# EAGLE design remote emergency switch (EAGLE 9.6.2)
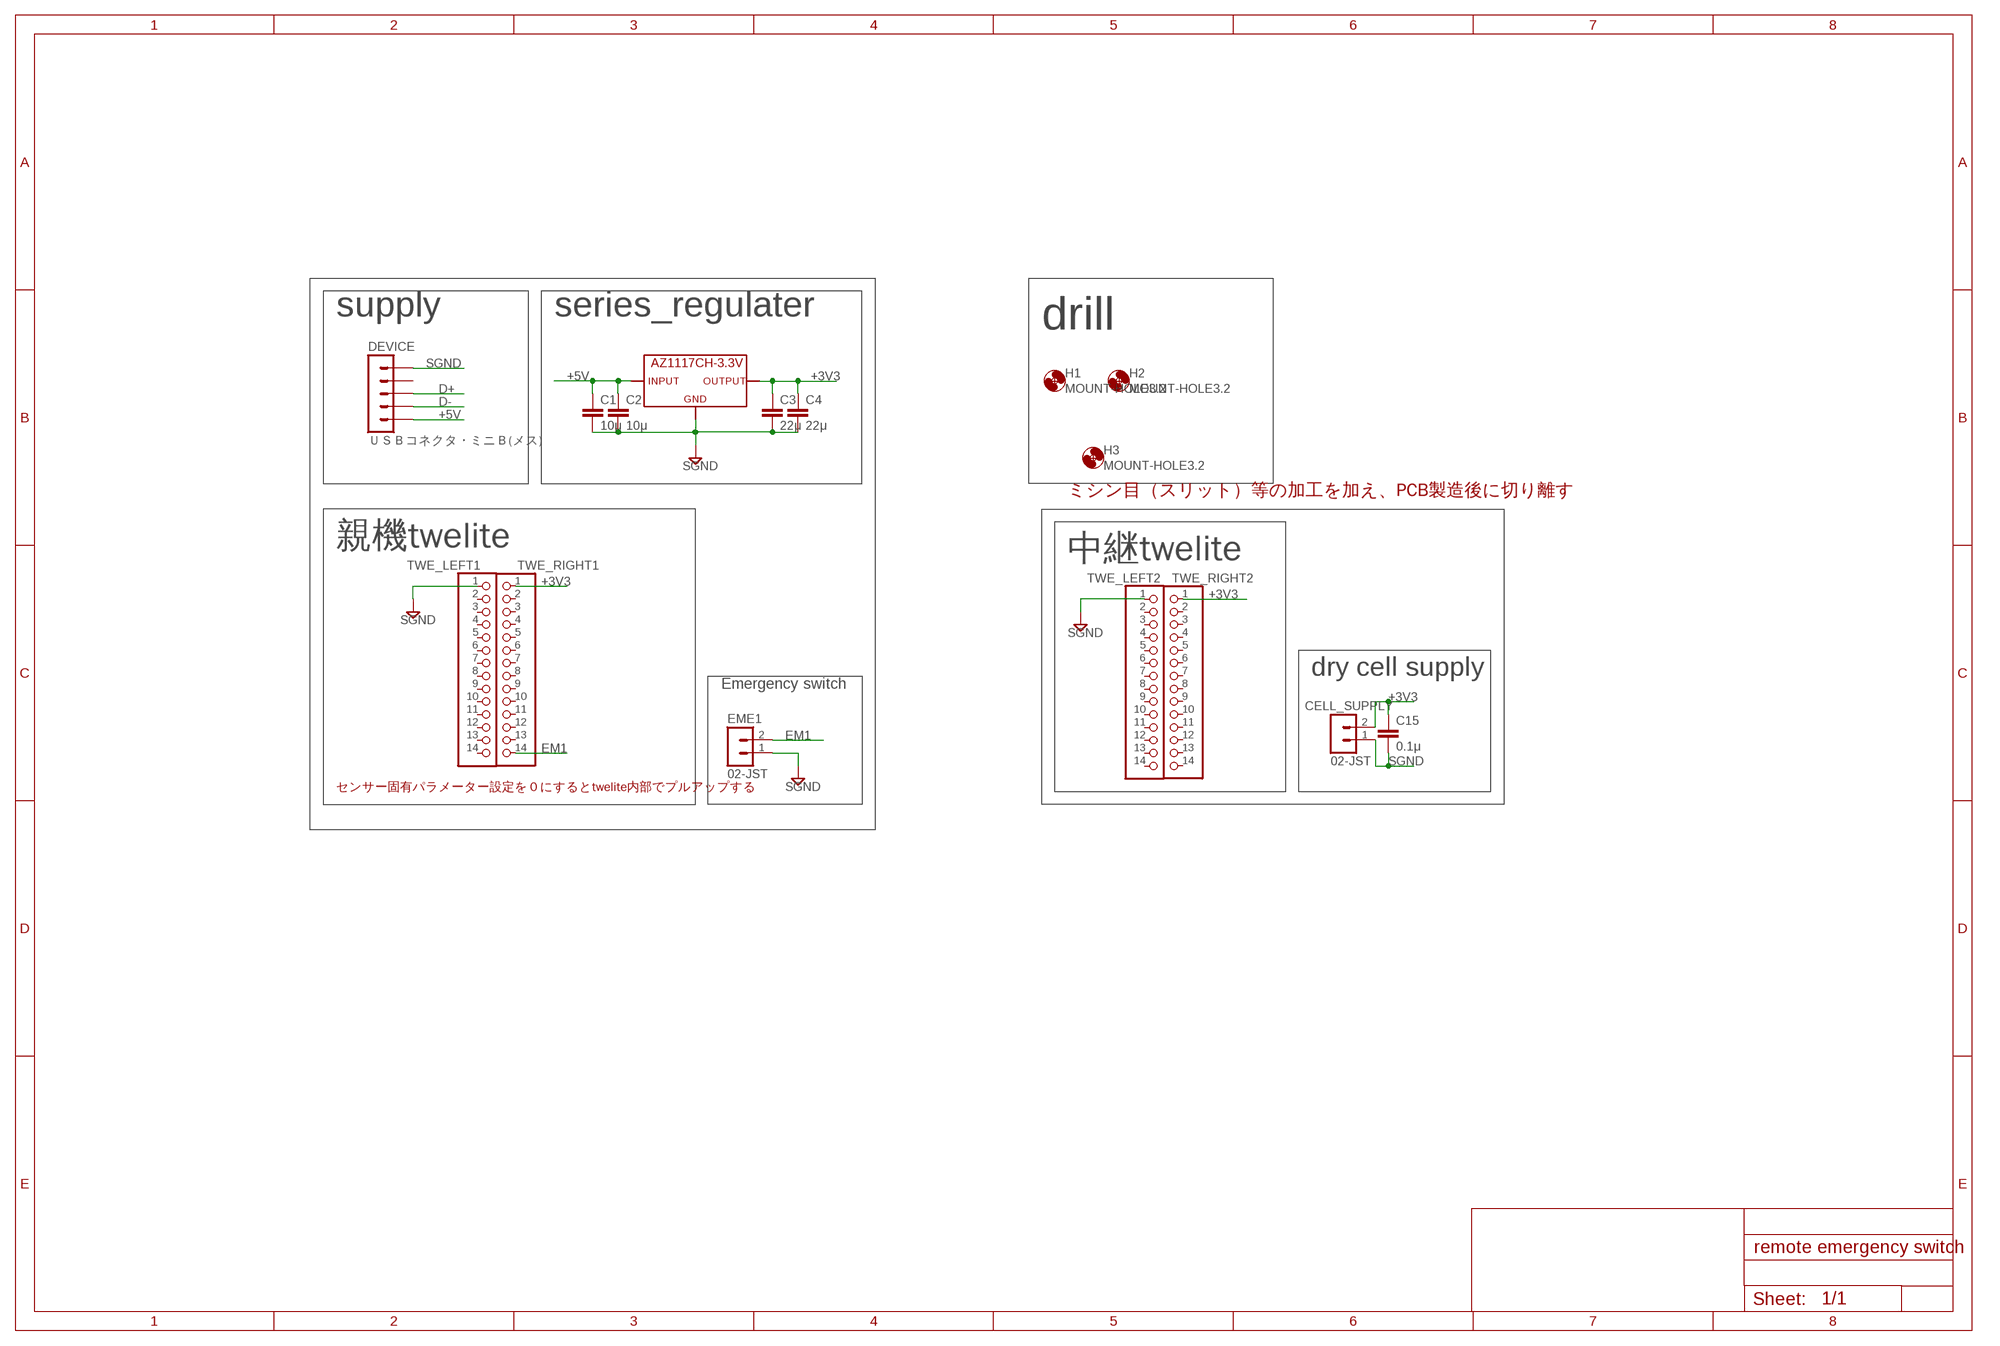
[diagram p0: schematic, sheet 1]

## Parts
C1  10μ  GRM0335C1E240GA01D  [GRM0335C1E240GA01D]
C2  10μ  GRM0335C1E240GA01D  [GRM0335C1E240GA01D]
C3  22μ  GRM0335C1E240GA01D  [GRM0335C1E240GA01D]
C4  22μ  GRM0335C1E240GA01D  [GRM0335C1E240GA01D]
C15  0.1μ  C-EU025-024X044  [C025-024X044]
CELL_SUPPLY  02-JST  [B2B-XH]
DEVICE  ＵＳＢコネクタ・ミニＢ(メス)  [ＵＳＢコネクタ・ミニＢ(メス)]
EME1  02-JST  [B2B-XH]
H1  MOUNT-HOLE3.2  [3,2]
H2  MOUNT-HOLE3.2  [3,2]
H3  MOUNT-HOLE3.2  [3,2]
REGYURETA  ３．３V  ＡＺ１１１７ＣＨ－３．３ＴＲＧ１  [ＡＺ１１１７ＣＨ－３．３ＴＲＧ１]
TWE_LEFT1  PINHD-1X14  [1X14]
TWE_LEFT2  PINHD-1X14  [1X14]
TWE_RIGHT1  PINHD-1X14  [1X14]
TWE_RIGHT2  PINHD-1X14  [1X14]

## Nets
+3V3: C3.1 C4.1 C15.1 CELL_SUPPLY.2 REGYURETA.OUTPUT REGYURETA.VOUT(OUTPUT) TWE_RIGHT1.1 TWE_RIGHT2.1
+5V: C1.1 C2.1 DEVICE.VBUS REGYURETA.INPUT
D+: DEVICE.D+
D-: DEVICE.D-
EM1: EME1.2 TWE_RIGHT1.14
SGND: C1.2 C2.2 C3.2 C4.2 C15.2 CELL_SUPPLY.1 DEVICE.GND EME1.1 REGYURETA.ADJ/GND(GND) TWE_LEFT1.1 TWE_LEFT2.1 ; supply symbol labelled GND
Unconnected: DEVICE.ID TWE_LEFT1.2 TWE_LEFT1.3 TWE_LEFT1.4 TWE_LEFT1.5 TWE_LEFT1.6 TWE_LEFT1.7 TWE_LEFT1.8 TWE_LEFT1.9 TWE_LEFT1.10 TWE_LEFT1.11 TWE_LEFT1.12 TWE_LEFT1.13 TWE_LEFT1.14 TWE_LEFT2.2 TWE_LEFT2.3 TWE_LEFT2.4 TWE_LEFT2.5 TWE_LEFT2.6 TWE_LEFT2.7 TWE_LEFT2.8 TWE_LEFT2.9 TWE_LEFT2.10 TWE_LEFT2.11 TWE_LEFT2.12 TWE_LEFT2.13 TWE_LEFT2.14 TWE_RIGHT1.2 TWE_RIGHT1.3 TWE_RIGHT1.4 TWE_RIGHT1.5 TWE_RIGHT1.6 TWE_RIGHT1.7 TWE_RIGHT1.8 TWE_RIGHT1.9 TWE_RIGHT1.10 TWE_RIGHT1.11 TWE_RIGHT1.12 TWE_RIGHT1.13 TWE_RIGHT2.2 TWE_RIGHT2.3 TWE_RIGHT2.4 TWE_RIGHT2.5 TWE_RIGHT2.6 TWE_RIGHT2.7 TWE_RIGHT2.8 TWE_RIGHT2.9 TWE_RIGHT2.10 TWE_RIGHT2.11 TWE_RIGHT2.12 TWE_RIGHT2.13 TWE_RIGHT2.14

## Notes on the sheet
- supply | series_regulater
- drill
- ミシン目（スリット）等の加工を加え、PCB製造後に切り離す
- 親機twelite
- 中継twelite
- dry cell supply
- Emergency switch
- センサー固有パラメーター設定を０にするとtwelite内部でプルアップする

## Library data of the parts
C1-C4 = GRM0335C1E240GA01D:GRM0335C1E240GA01D
C15 = rcl:C-EU: CAPACITOR, European symbol; SPICEPREFIX: C
CELL_SUPPLY EME1 = con-jst-xh (1):02-JST: JST CONNECTOR
DEVICE = ＵＳＢコネクタ・ミニＢ(メス):ＵＳＢコネクタ・ミニＢ(メス)
H1-H3 = holes:MOUNT-HOLE: MOUNTING HOLE with drill center marker
REGYURETA = AZ1117CH-3.3TRG1:ＡＺ１１１７ＣＨ－３．３ＴＲＧ１
TWE_LEFT1 TWE_LEFT2 TWE_RIGHT1 TWE_RIGHT2 = pinhead:PINHD-1X14: PIN HEADER

## Board
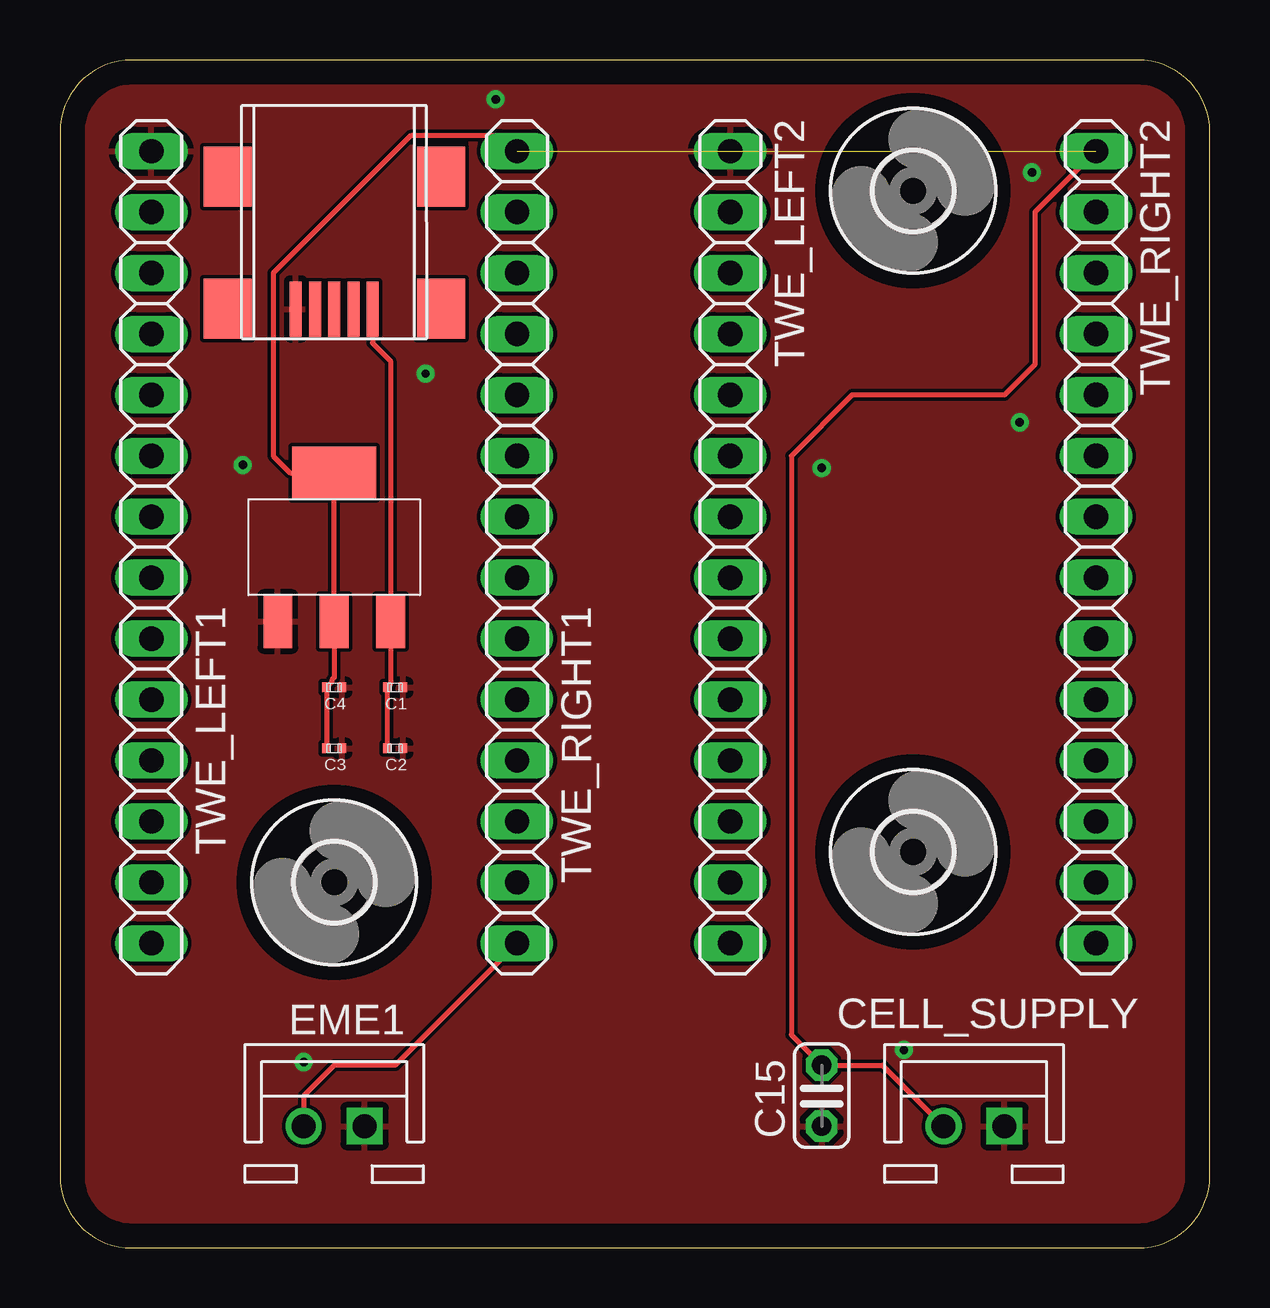
[diagram p1: board, top side]
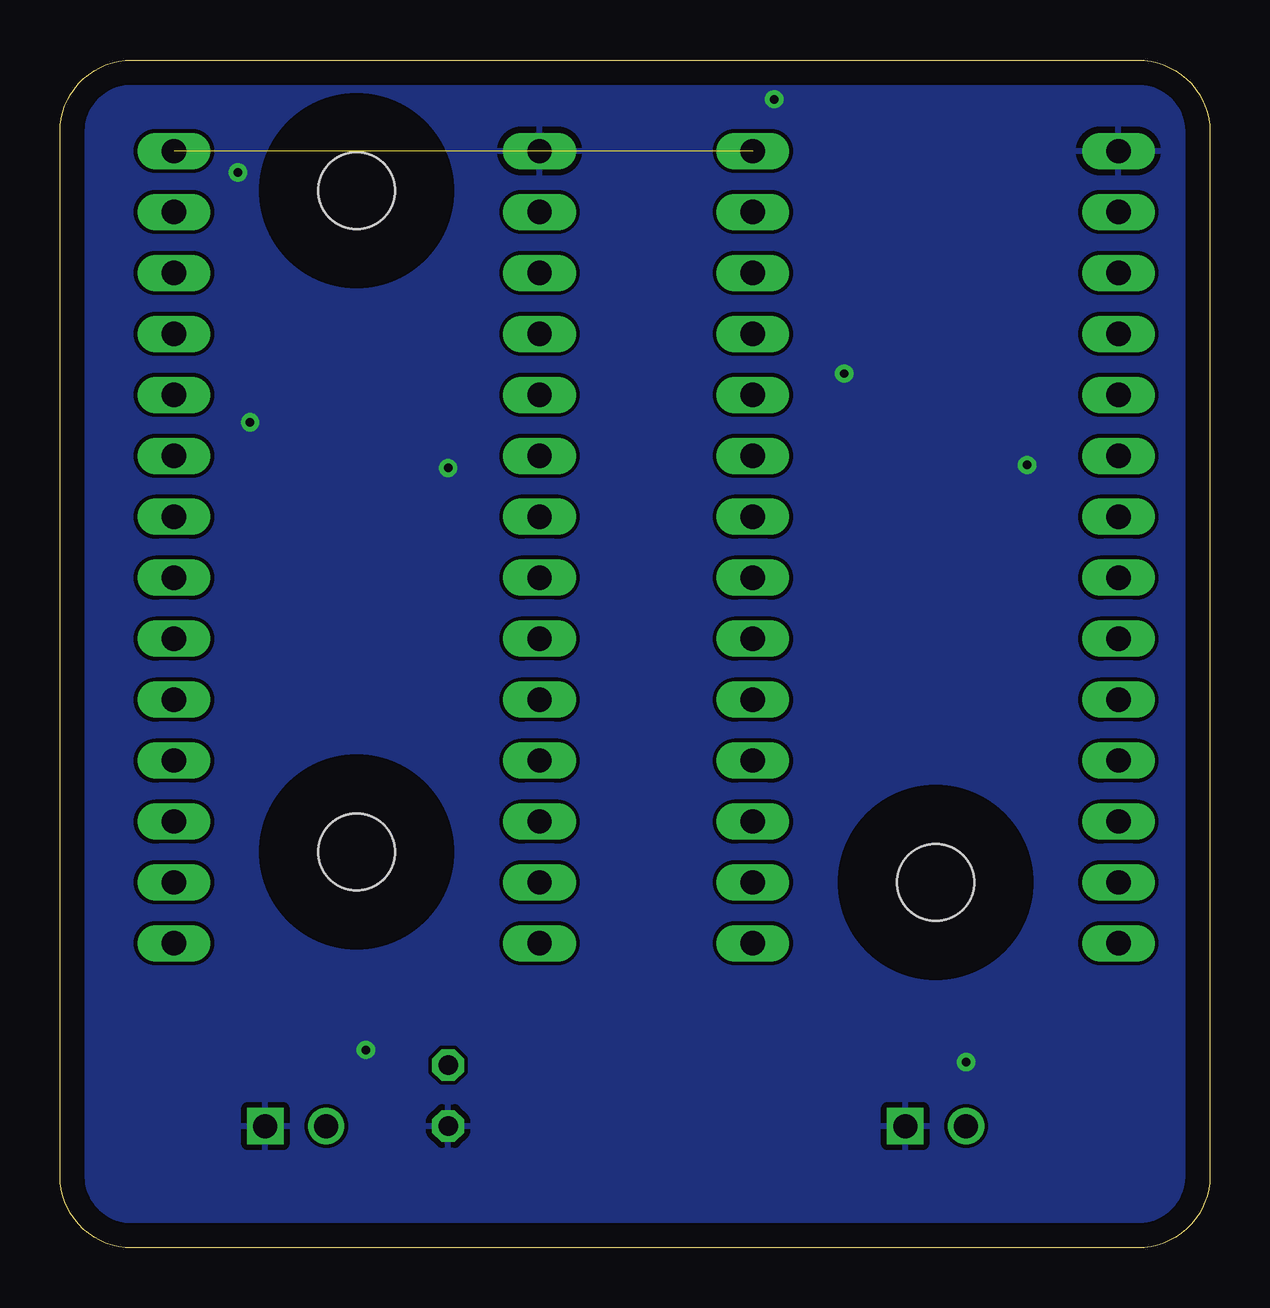
[diagram p2: board, bottom side, seen from below]

Size 47.93 x 49.52 mm. Coordinates in mm from the lower left corner, seen from the top.
Outline: 0,46.52 0,3 arc90 3,0 44.93,0 arc90 47.93,3 47.93,46.52 arc90 44.93,49.52 3,49.52 arc90 0,46.52
Copper layers (1*16): Top 0.035mm / dielectric 1.5mm / Bottom 0.035mm
Design rules "default": minimum track width 6mil, minimum drill 0.35mm, track to track 6mil, track to pad 6mil, pad to pad 6mil, via to via 6mil, smd to smd 6mil, copper to edge 40mil, drill to drill 6mil, minimum pad ring 10mil, minimum via ring 8mil, stop-mask expansion 4mil, vias tented up to drill 0mil, thermal gap 10mil

### Footprints (pad centres in the part's own frame; a part is rotated, then mirrored left to right if it is on the bottom)
GRM0335C1E240GA01D = smd 0.35 x 0.4: 1 -0.325,0; 2 0.325,0
C025-024X044 = drill 0.813 octagon: 1 -1.27,0; 2 1.27,0
B2B-XH = drill 1 square: 1 1.27,0 | drill 1: 2 -1.27,0
ＵＳＢコネクタ・ミニＢ(メス) = smd 0.5 x 2.3: D+ 0,2.77; D- -0.8,2.77; GND 1.6,2.77; ID 0.8,2.77; VBUS -1.6,2.77 | smd 2 x 2.5: P$6 -4.45,2.75; P$7 -4.45,-2.75; P$8 4.45,2.75; P$9 4.45,-2.75
3,2 = hole 3.2: 0,0
ＡＺ１１１７ＣＨ－３．３ＴＲＧ１ = smd 1.2 x 2.2: ADJ/GND -2.35,-3.1; INPUT 2.35,-3.1; OUTPUT 0,-3.1 | smd 3.5 x 2.2: VOUT 0,3.1
1X14 = drill 1.016 long: 1 -16.51,0; 2 -13.97,0; 3 -11.43,0; 4 -8.89,0; 5 -6.35,0; 6 -3.81,0; 7 -1.27,0; 8 1.27,0; 9 3.81,0; 10 6.35,0; 11 8.89,0; 12 11.43,0; 13 13.97,0; 14 16.51,0

### Placement (x,y rotation side)
C1  13.97,23.37 0 top
C2  13.97,20.83 0 top
C3  11.43,20.83 0 top
C4  11.43,23.37 0 top
C15  31.75,6.35 270 top
CELL_SUPPLY  38.1,5.08 0 top
DEVICE  11.43,41.91 180 top
EME1  11.43,5.08 0 top
H1  35.56,44.07 0 top
H2  35.56,16.51 0 top
H3  11.43,15.24 0 top
REGYURETA  11.43,29.21 0 top
TWE_LEFT1  3.81,29.21 270 top
TWE_LEFT2  27.94,29.21 270 top
TWE_RIGHT1  19.05,29.21 270 top
TWE_RIGHT2  43.18,29.21 270 top

### Tracks (layer width: path | path; a pad name or v marks a point on that pad's centre or on a via)
+3V3  (1 unrouted)
  Top 0.2: CELL_SUPPLY.2 34.29,7.62 C15.1 30.48,8.89 30.48,33.02 33.02,35.56 39.37,35.56 40.64,36.83 40.64,43.18 TWE_RIGHT2.1 | TWE_RIGHT1.1 18.41,46.35 14.61,46.35 8.89,40.64 8.89,33.02 9.6,32.31 REGYURETA.VOUT REGYURETA.OUTPUT 11.43,23.77 11.33,23.67 11.33,23.59 C4.1 C3.1
+5V
  Top 0.2: C2.1 C1.1 13.78,23.5 REGYURETA.INPUT 13.78,36.98 13.03,37.73 DEVICE.VBUS
EM1
  Top 0.2: TWE_RIGHT1.14 13.97,7.62 11.43,7.62 10.16,6.35 EME1.2
SGND  (via drill 0.35)
  other vias: 7.62,32.64 15.24,36.45 10.16,7.75 35.18,8.26 31.75,32.51 40.01,34.42 40.51,44.83 18.16,47.88
  pour Top: 0,50.8 -1.27,49.53 -1.27,1.27 1.27,-1.27 46.99,-1.27 49.53,1.27 49.53,48.26 46.99,50.8
  pour Bottom: 1.27,50.8 -1.27,48.26 -1.27,2.54 2.54,-1.27 46.99,-1.27 49.53,1.27 49.53,46.99 45.72,50.8